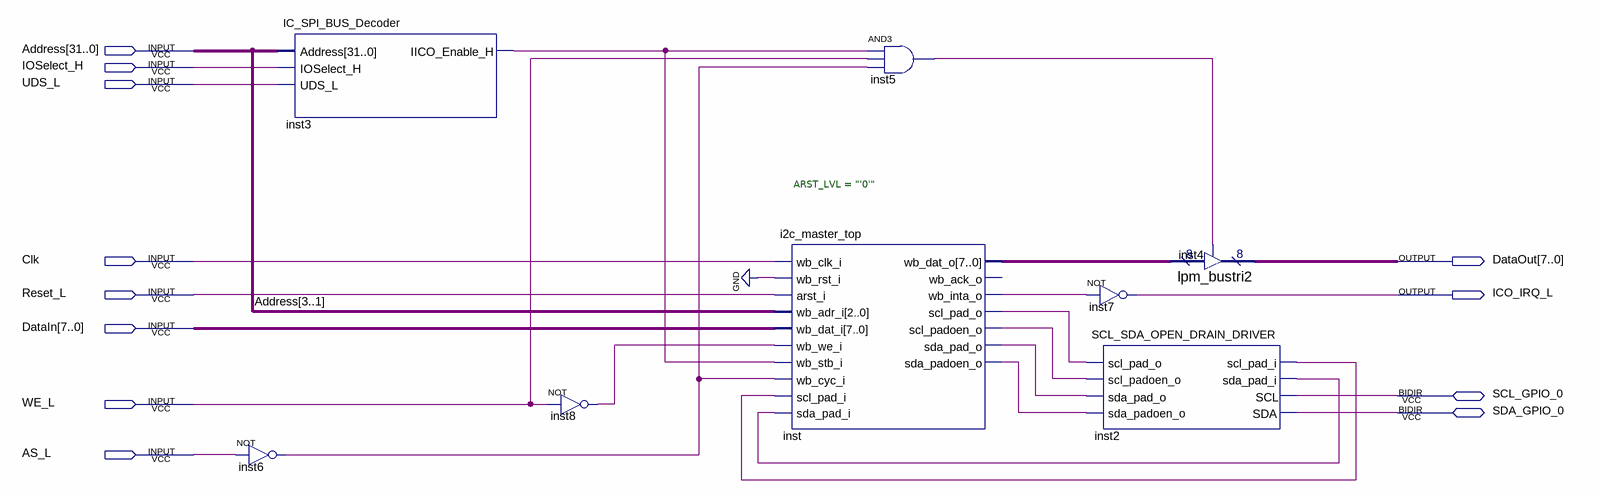
[diagram p0: schematic sheet]
// Quartus schematic IIC_SPI_Interface.bdf as structural Verilog: 8 symbols, 12 pins
module IIC_SPI_Interface (
  input  [31:0] Address,
  input  IOSelect_H,
  input  UDS_L,
  input  Clk,
  input  Reset_L,
  input  [7:0] DataIn,
  input  WE_L,
  input  AS_L,
  inout  SCL_GPIO_0,
  inout  SDA_GPIO_0,
  output [7:0] DataOut,
  output ICO_IRQ_L
);

  wire inst2_scl_pad_i, inst2_sda_pad_i, inst3_iico_enable_h, inst5_out, inst6_out, inst8_out,
       inst_scl_pad_o, inst_scl_padoen_o, inst_sda_pad_o, inst_sda_padoen_o, inst_wb_inta_o;
  wire [7:0] inst_wb_dat_o;

  not inst6 (inst6_out, AS_L);
  IC_SPI_BUS_Decoder inst3 (
    .Address(Address), .IOSelect_H(IOSelect_H), .UDS_L(UDS_L), .IICO_Enable_H(inst3_iico_enable_h));
  not inst8 (inst8_out, WE_L);
  i2c_master_top #(.ARST_LVL("'0'")) inst (
    .wb_clk_i(Clk), .wb_rst_i(1'b0), .arst_i(Reset_L), .wb_adr_i(Address[3:1]), .wb_dat_i(DataIn),
    .wb_we_i(inst8_out), .wb_stb_i(inst3_iico_enable_h), .wb_cyc_i(inst6_out), .scl_pad_i(inst2_scl_pad_i),
    .sda_pad_i(inst2_sda_pad_i), .wb_dat_o(inst_wb_dat_o), .wb_inta_o(inst_wb_inta_o),
    .scl_pad_o(inst_scl_pad_o), .scl_padoen_o(inst_scl_padoen_o), .sda_pad_o(inst_sda_pad_o),
    .sda_padoen_o(inst_sda_padoen_o));  // open: wb_ack_o
  and inst5 (inst5_out, inst3_iico_enable_h, WE_L, inst6_out);
  not inst7 (ICO_IRQ_L, inst_wb_inta_o);
  SCL_SDA_OPEN_DRAIN_DRIVER inst2 (
    .scl_pad_o(inst_scl_pad_o), .scl_padoen_o(inst_scl_padoen_o), .sda_pad_o(inst_sda_pad_o),
    .sda_padoen_o(inst_sda_padoen_o), .scl_pad_i(inst2_scl_pad_i), .sda_pad_i(inst2_sda_pad_i),
    .SCL(SCL_GPIO_0), .SDA(SDA_GPIO_0));
  lpm_bustri2 inst4 (.enabledt(inst5_out), .data(inst_wb_dat_o), .tridata(DataOut));
endmodule
